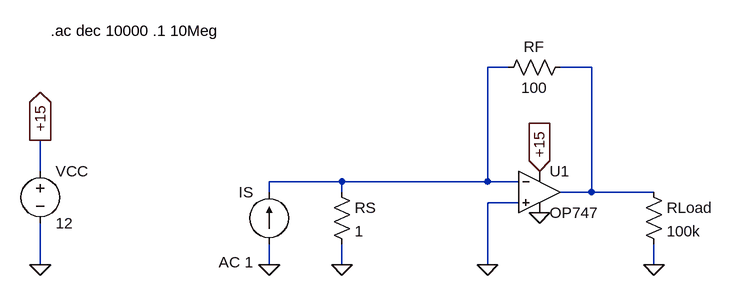
[diagram p0: schematic Realimentacao - Paralelo - Paralelo.asc]
Realimentacao - Paralelo - Paralelo.asc, the LTspice schematic file:
Version 4
SHEET 1 2308 1204
WIRE 304 -32 272 -32
WIRE 432 -32 384 -32
WIRE -416 128 -416 80
WIRE 48 144 -64 144
WIRE 272 144 272 -32
WIRE 272 144 48 144
WIRE 320 144 272 144
WIRE -64 160 -64 144
WIRE 48 160 48 144
WIRE 432 160 432 -32
WIRE 432 160 384 160
WIRE 528 160 432 160
WIRE 320 176 272 176
WIRE -416 272 -416 208
WIRE -64 272 -64 240
WIRE 48 272 48 240
WIRE 272 272 272 176
WIRE 528 272 528 240
FLAG -416 272 0
FLAG -416 80 +15
IOPIN -416 80 Out
FLAG 352 128 +15
IOPIN 352 128 In
FLAG 352 192 0
FLAG 272 272 0
FLAG 48 272 0
FLAG 528 272 0
FLAG -64 272 0
SYMBOL voltage -416 112 R0
WINDOW 123 0 0 Left 0
WINDOW 39 0 0 Left 0
SYMATTR InstName VCC
SYMATTR Value 12
SYMBOL Opamps\\OP747 352 96 R0
SYMATTR InstName U1
SYMBOL res 400 -48 R90
WINDOW 0 0 56 VBottom 2
WINDOW 3 32 56 VTop 2
SYMATTR InstName RF
SYMATTR Value 100
SYMBOL res 32 144 R0
SYMATTR InstName RS
SYMATTR Value 1
SYMBOL res 512 144 R0
SYMATTR InstName RLoad
SYMATTR Value 100k
SYMBOL current -64 240 R180
WINDOW 0 24 80 Left 2
WINDOW 3 24 0 Left 2
WINDOW 123 24 -28 Left 2
WINDOW 39 0 0 Left 0
SYMATTR InstName IS
SYMATTR Value ""
SYMATTR Value2 AC 1
TEXT -400 -88 Left 2 !.ac dec 10000 .1 10Meg

The netlist it stands for:
* Realimentacao - Paralelo - Paralelo.asc
VCC +15 0 12
XU1 0 N001 +15 0 N002 OP747  ; pins In+ In- V+ V- OUT
RF N002 N001 100
RS N001 0 1
RLoad N002 0 100k
IS 0 N001 AC 1
.ac dec 10000 .1 10Meg
.backanno
.end